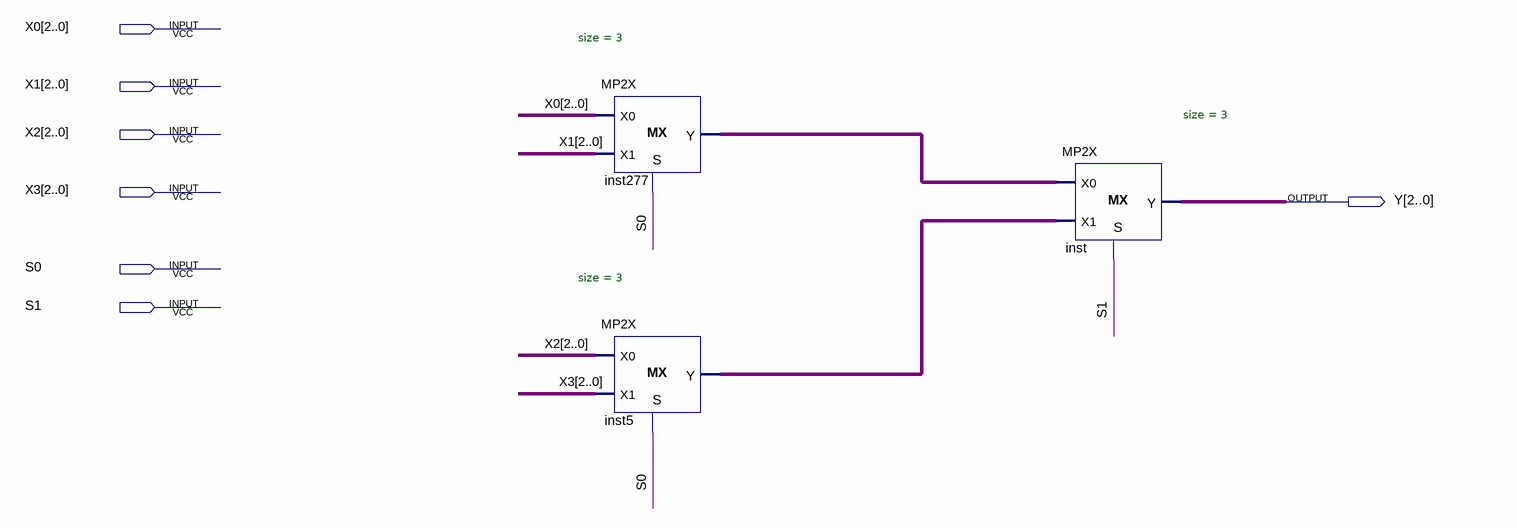
[diagram p0: schematic sheet]
// Quartus schematic MX423bit.bdf as structural Verilog: 3 symbols, 7 pins
module MX423bit (
  input  [2:0] X0,
  input  [2:0] X1,
  input  [2:0] X2,
  input  [2:0] X3,
  input  S0,
  input  S1,
  output [2:0] Y
);

  wire [2:0] inst5_y, inst277_y;

  MP2X #(.size(3)) inst277 (.S(S0), .X0(X0), .X1(X1), .Y(inst277_y));
  MP2X #(.size(3)) inst5 (.S(S0), .X0(X2), .X1(X3), .Y(inst5_y));
  MP2X #(.size(3)) inst (.S(S1), .X0(inst277_y), .X1(inst5_y), .Y(Y));
endmodule
